# EAGLE design ModuleCarrier-Laird-BL600-v1.1 (EAGLE 7.7.0)

## Sheet 1 of 2
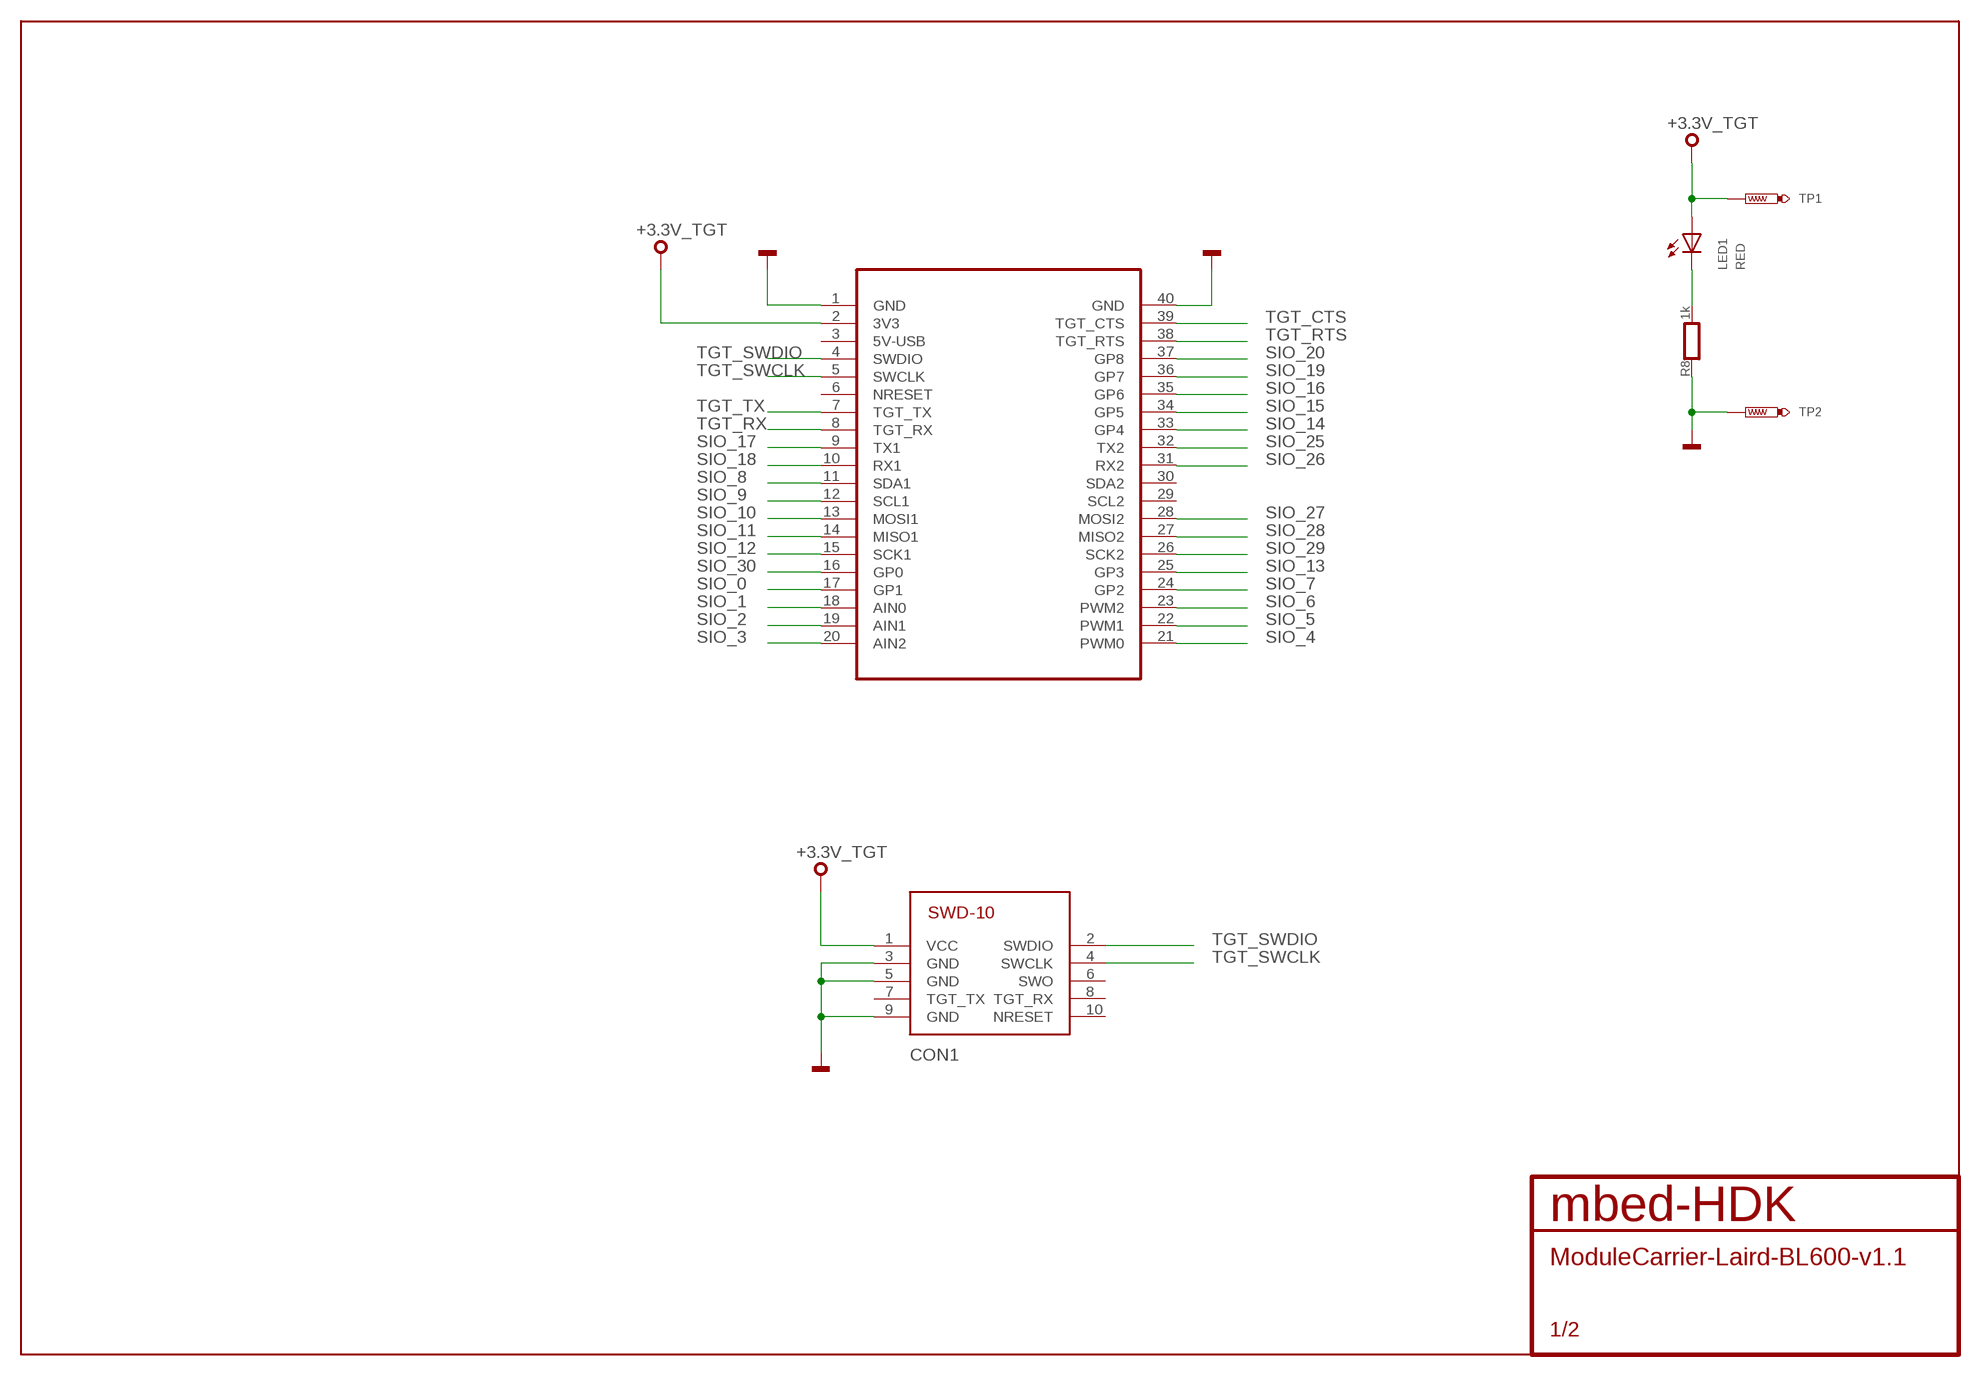
[diagram p0: schematic, sheet 1]

### Parts
CON1  SWD-10/TC2050_SMD  [FTSH-105-02]
LED1  RED  SMD_LED0603  [CHIPLED_0603]
R8  1k  RESISTOR0603  [0603]
TP1  TEST-POINT-50R-PTH  [TP50-PTH]
TP2  TEST-POINT-50R-PTH  [TP50-PTH]
U$1  MODULE_DAUGHTER  [MODULE_DAUGHTER]

### Nets
+3.3V_TGT: CON1.1(VCC) LED1.A TP1.TP U$1.2(3V3) ; also sheet 2
GND: CON1.3(GND) CON1.5(GND) CON1.9(GND) R8.1 TP2.TP U$1.1(GND) U$1.40(GND) ; also sheet 2
PA_1: LED1.C R8.2
SIO_0: U$1.17(GP1) ; also sheet 2
SIO_1: U$1.18(AIN0) ; also sheet 2
SIO_2: U$1.19(AIN1) ; also sheet 2
SIO_3: U$1.20(AIN2) ; also sheet 2
SIO_4: U$1.21(PWM0) ; also sheet 2
SIO_5: U$1.22(PWM1) ; also sheet 2
SIO_6: U$1.23(PWM2) ; also sheet 2
SIO_7: U$1.24(GP2) ; also sheet 2
SIO_8: U$1.11(SDA1) ; also sheet 2
SIO_9: U$1.12(SCL1) ; also sheet 2
SIO_10: U$1.13(MOSI1) ; also sheet 2
SIO_11: U$1.14(MISO1) ; also sheet 2
SIO_12: U$1.15(SCK1) ; also sheet 2
SIO_13: U$1.25(GP3) ; also sheet 2
SIO_14: U$1.33(GP4) ; also sheet 2
SIO_15: U$1.34(GP5) ; also sheet 2
SIO_16: U$1.35(GP6) ; also sheet 2
SIO_17: U$1.9(TX1) ; also sheet 2
SIO_18: U$1.10(RX1) ; also sheet 2
SIO_19: U$1.36(GP7) ; also sheet 2
SIO_20: U$1.37(GP8) ; also sheet 2
SIO_25: U$1.32(TX2) ; also sheet 2
SIO_26: U$1.31(RX2) ; also sheet 2
SIO_27: U$1.28(MOSI2) ; also sheet 2
SIO_28: U$1.27(MISO2) ; also sheet 2
SIO_29: U$1.26(SCK2) ; also sheet 2
SIO_30: U$1.16(GP0) ; also sheet 2
TGT_CTS: U$1.39(TGT_CTS) ; also sheet 2
TGT_RTS: U$1.38(TGT_RTS) ; also sheet 2
TGT_RX: U$1.8(TGT_RX) ; also sheet 2
TGT_SWCLK: CON1.4(SWCLK) U$1.5(SWCLK) ; also sheet 2
TGT_SWDIO: CON1.2(SWDIO) U$1.4(SWDIO) ; also sheet 2
TGT_TX: U$1.7(TGT_TX) ; also sheet 2
Unconnected: CON1.6(SWO) CON1.7(TGT_TX) CON1.8(TGT_RX) CON1.10(NRESET) U$1.3(5V-USB) U$1.6(NRESET) U$1.29(SCL2) U$1.30(SDA2)

## Sheet 2 of 2
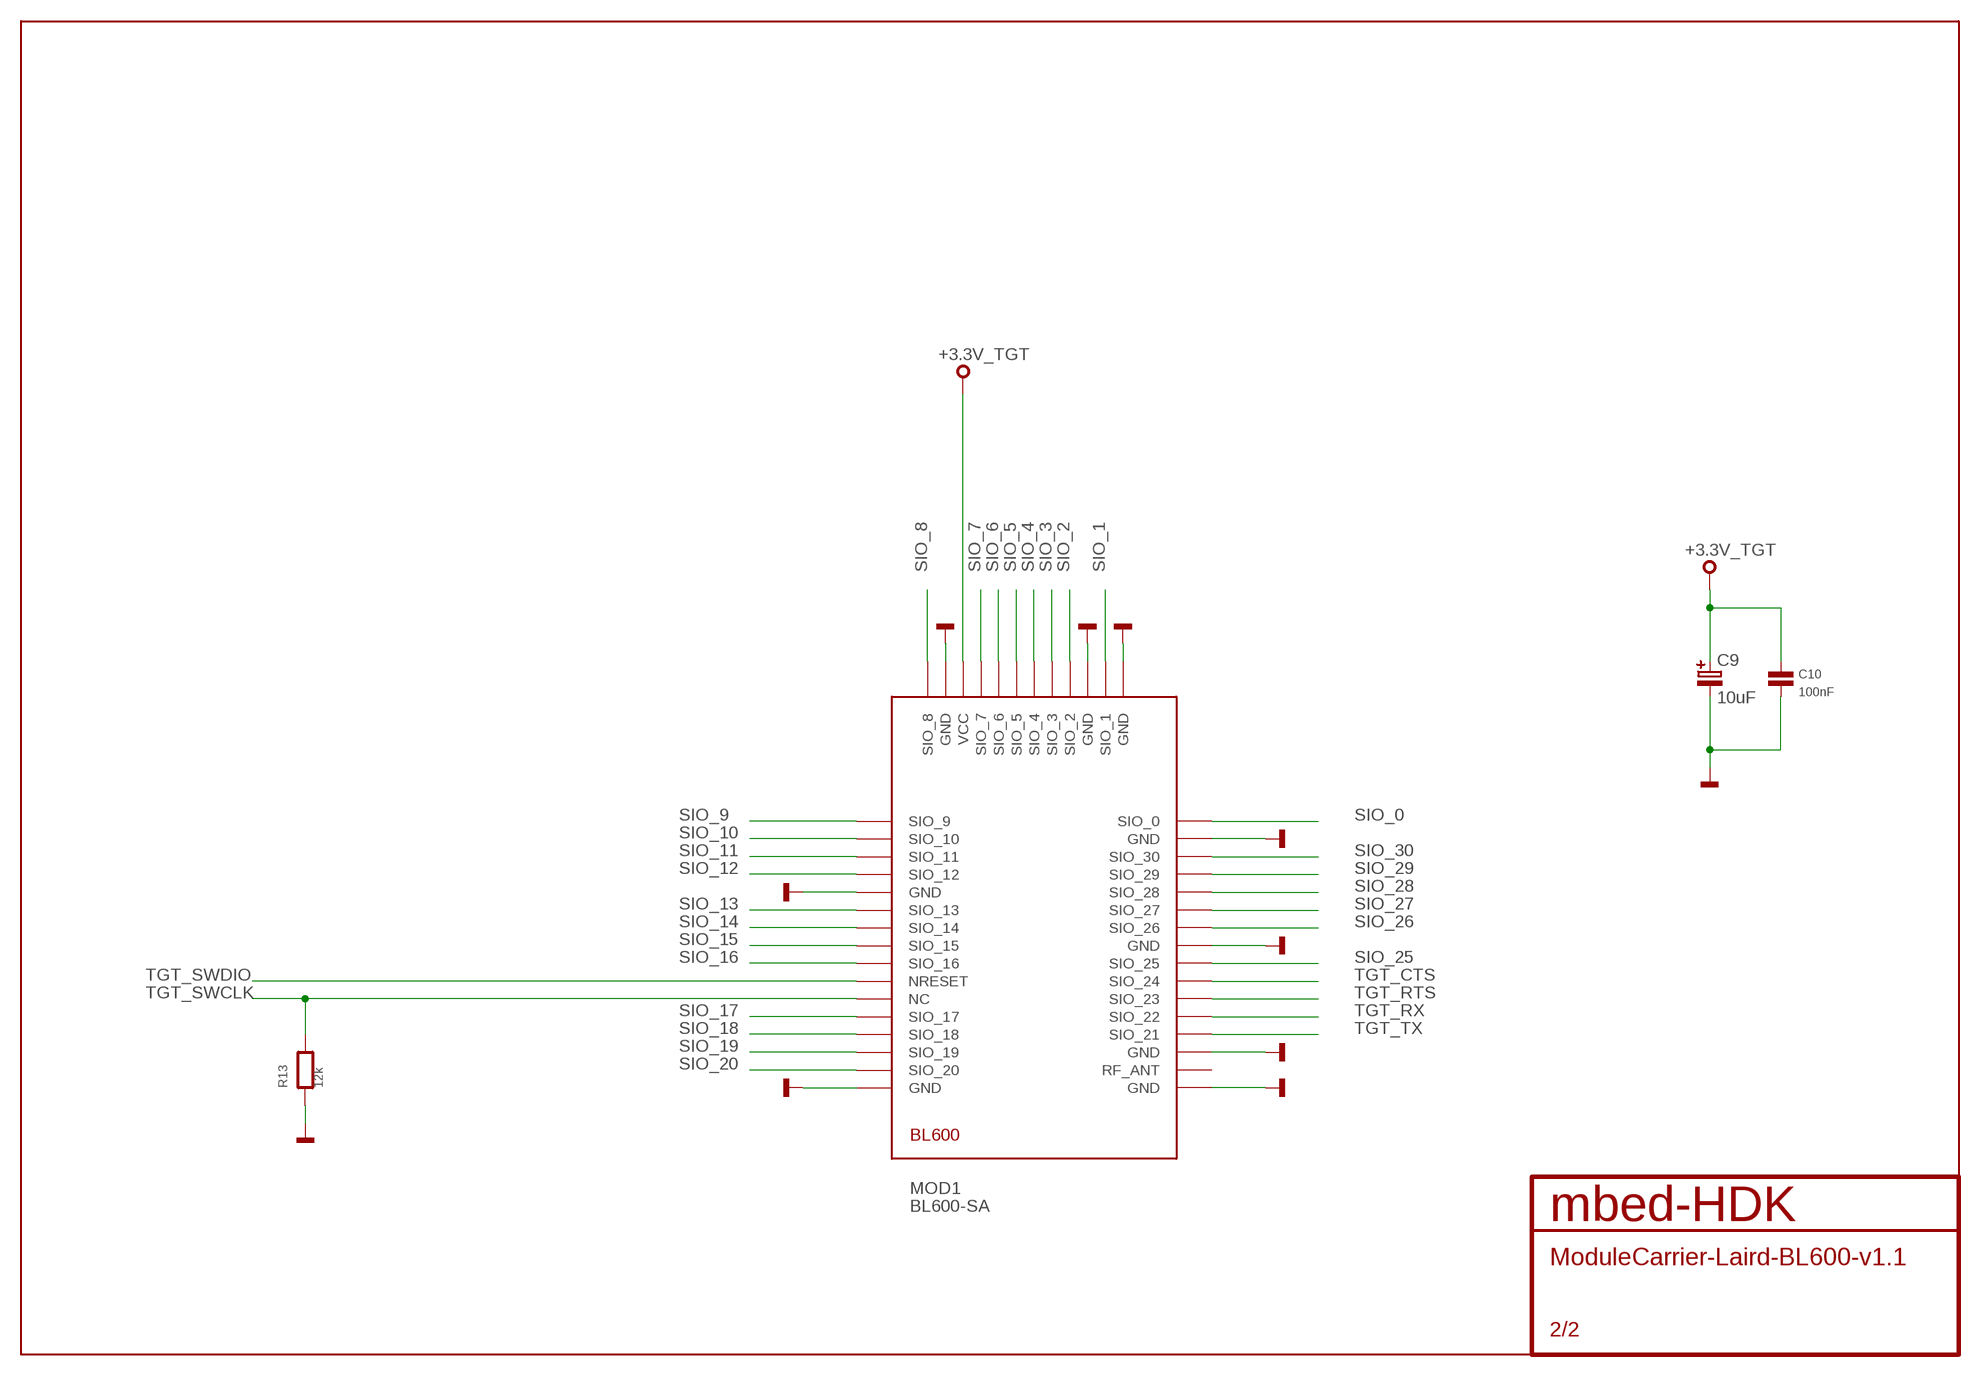
[diagram p1: schematic, sheet 2]

### Parts
C9  10uF  C-POLB  [CASE-B]
C10  100nF  C0603  [0603]
MOD1  BL600-SA  [BL600]
R13  12k  R0603  [0603]

### Nets
+3.3V_TGT: C9.1 C10.1 MOD1.P$10(VCC) ; also sheet 1
GND: C9.2 C10.2 MOD1.P$1(GND) MOD1.P$3(GND) MOD1.P$11(GND) MOD1.P$17(GND) MOD1.P$28(GND) MOD1.P$29(GND) MOD1.P$31(GND) MOD1.P$37(GND) MOD1.P$43(GND) R13.1 ; also sheet 1
SIO_0: MOD1.P$44(SIO_0) ; also sheet 1
SIO_1: MOD1.P$2(SIO_1) ; also sheet 1
SIO_2: MOD1.P$4(SIO_2) ; also sheet 1
SIO_3: MOD1.P$5(SIO_3) ; also sheet 1
SIO_4: MOD1.P$6(SIO_4) ; also sheet 1
SIO_5: MOD1.P$7(SIO_5) ; also sheet 1
SIO_6: MOD1.P$8(SIO_6) ; also sheet 1
SIO_7: MOD1.P$9(SIO_7) ; also sheet 1
SIO_8: MOD1.P$12(SIO_8) ; also sheet 1
SIO_9: MOD1.P$13(SIO_9) ; also sheet 1
SIO_10: MOD1.P$14(SIO_10) ; also sheet 1
SIO_11: MOD1.P$15(SIO_11) ; also sheet 1
SIO_12: MOD1.P$16(SIO_12) ; also sheet 1
SIO_13: MOD1.P$18(SIO_13) ; also sheet 1
SIO_14: MOD1.P$19(SIO_14) ; also sheet 1
SIO_15: MOD1.P$20(SIO_15) ; also sheet 1
SIO_16: MOD1.P$21(SIO_16) ; also sheet 1
SIO_17: MOD1.P$24(SIO_17) ; also sheet 1
SIO_18: MOD1.P$25(SIO_18) ; also sheet 1
SIO_19: MOD1.P$26(SIO_19) ; also sheet 1
SIO_20: MOD1.P$27(SIO_20) ; also sheet 1
SIO_25: MOD1.P$36(SIO_25) ; also sheet 1
SIO_26: MOD1.P$38(SIO_26) ; also sheet 1
SIO_27: MOD1.P$39(SIO_27) ; also sheet 1
SIO_28: MOD1.P$40(SIO_28) ; also sheet 1
SIO_29: MOD1.P$41(SIO_29) ; also sheet 1
SIO_30: MOD1.P$42(SIO_30) ; also sheet 1
TGT_CTS: MOD1.P$35(SIO_24) ; also sheet 1
TGT_RTS: MOD1.P$34(SIO_23) ; also sheet 1
TGT_RX: MOD1.P$33(SIO_22) ; also sheet 1
TGT_SWCLK: MOD1.P$23(NC) R13.2 ; also sheet 1
TGT_SWDIO: MOD1.P$22(NRESET) ; also sheet 1
TGT_TX: MOD1.P$32(SIO_21) ; also sheet 1
Unconnected: MOD1.P$30(RF_ANT)

## Library data of the parts
C9 = mbed-HDK:C-POL: Polarised capacitor
C10 = mbed-HDK:C: Capacitor
CON1 = mbed-HDK-Connector:SWD-10/TC2050: 1mm pitch 10-Pin Cortex Programming Header with optional TC2050 footprint solderless interchangeable
LED1 = mbed-HDK-Optical:SMD_LED: LED SMD, Colour Red; MF: Wurth Electronics Inc; MFN: 150060RS75000; OC-DIGIKEY: 732-4978-1-ND; OC-MOUSER: 710-150060RS75000; OC-NEWARK: 2322071
MOD1 = laird:BL600
R8 = mbed-HDK-RLC:RESISTOR: Resistor
R13 = mbed-HDK:R
TP1 TP2 = mbed-HDK:TEST-POINT
U$1 = Treadstone:MODULE_DAUGHTER

## Net classes
0 default: width 0.152 mm, drill 0.305 mm, clearance 0.152 mm

## Board
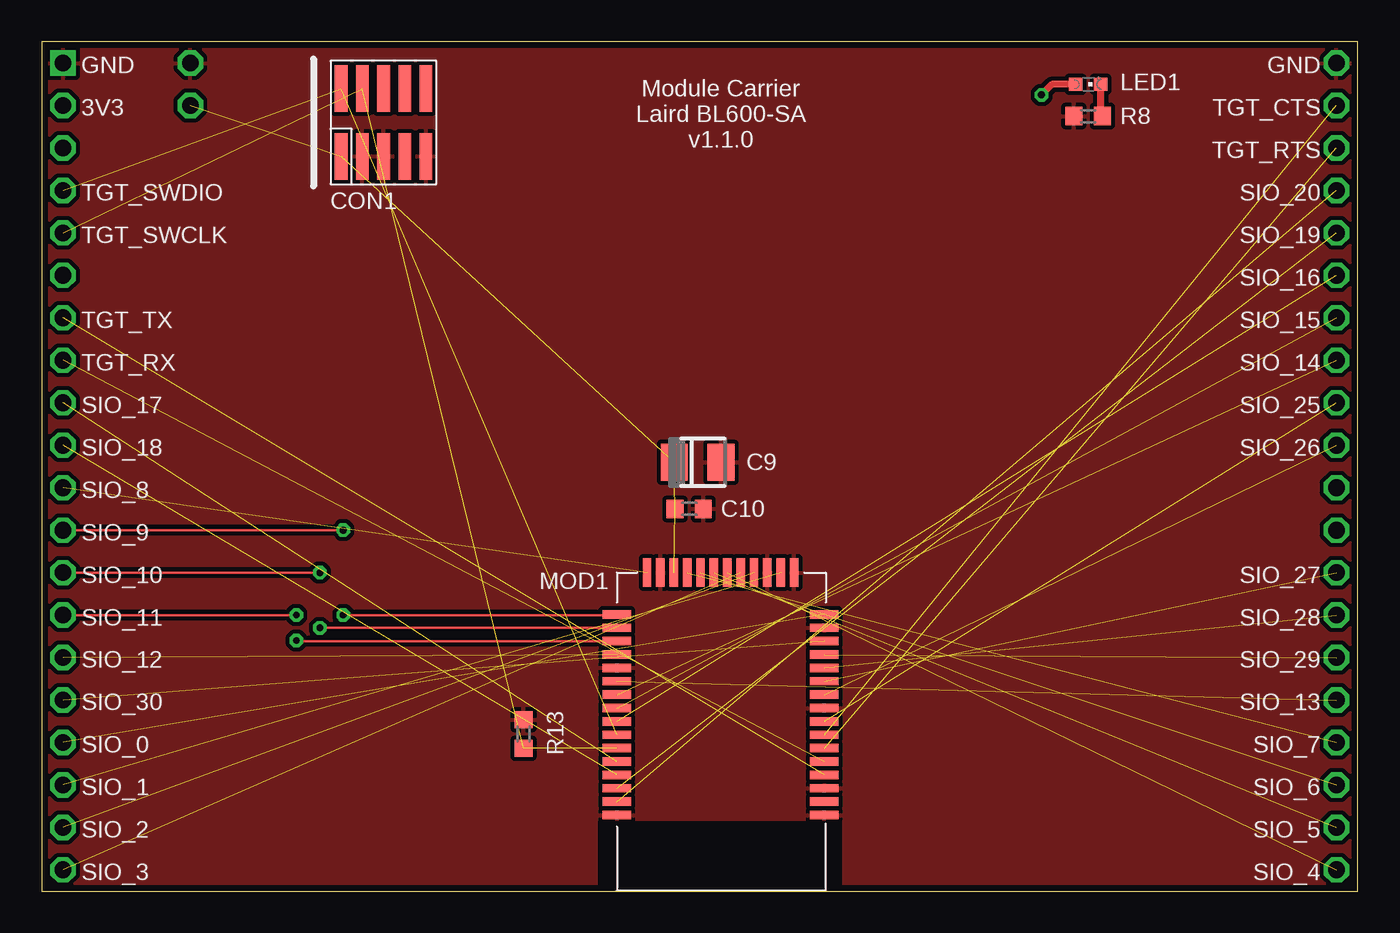
[diagram p2: board, top side]
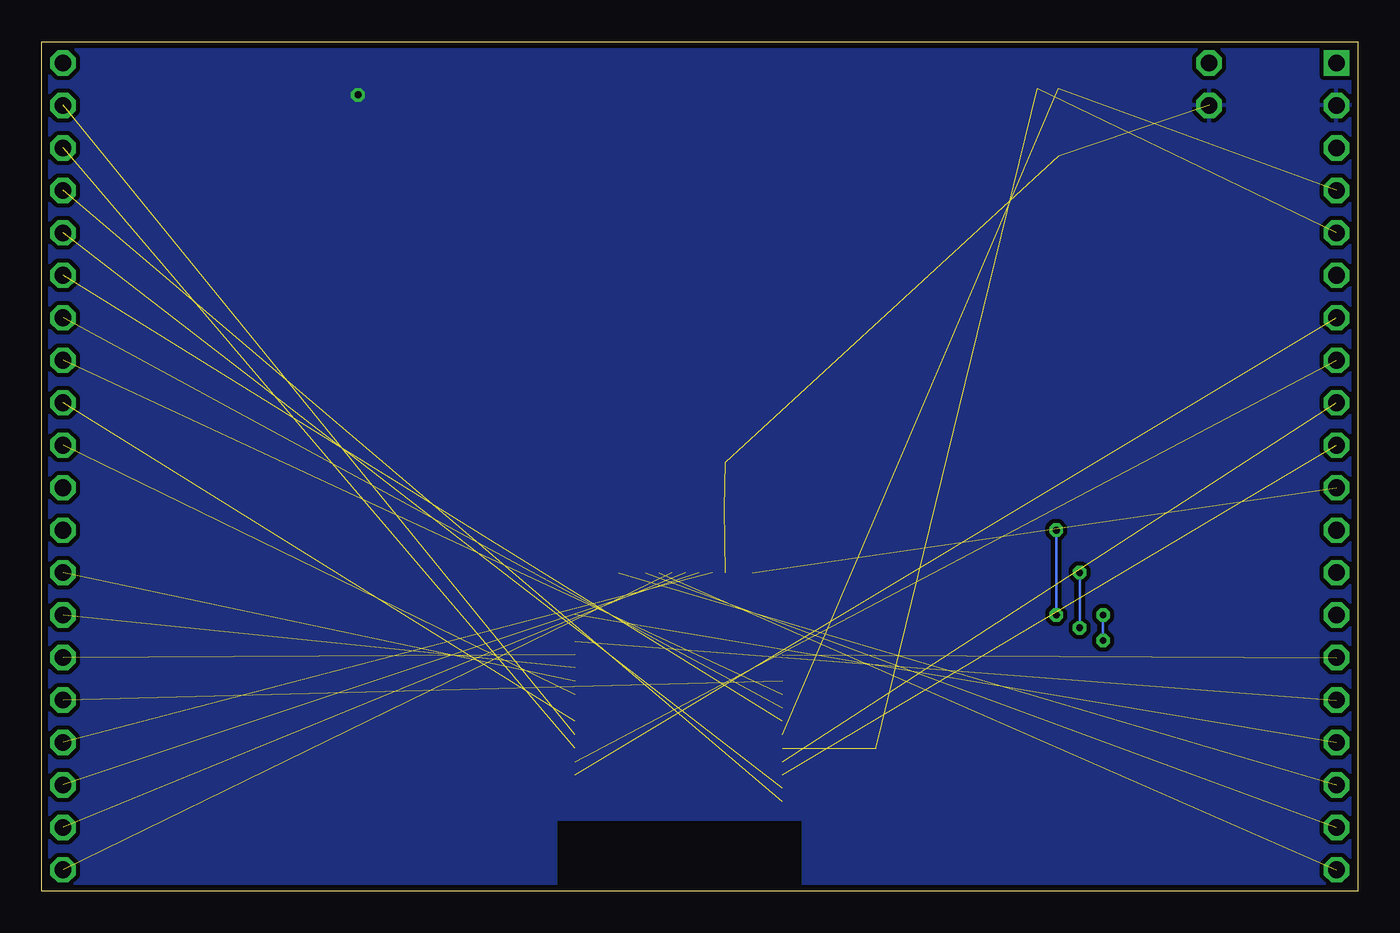
[diagram p3: board, bottom side, seen from below]

Size 78.74 x 50.8 mm. Coordinates in mm from the lower left corner, seen from the top.
Copper layers ((1*16)): Top 0.035mm / dielectric 0.8mm / Bottom 0.035mm
Design rules "mbed-HDK-6-6-2-layer-PCB-Panel": minimum track width 6mil, minimum drill 14mil, track to track 10mil, track to pad 10mil, pad to pad 10mil, via to via 10mil, smd to smd 6mil, copper to edge 15mil, drill to drill 8mil, minimum pad ring 10mil, minimum via ring 8mil, stop-mask expansion 4mil, vias tented up to drill 0mil, thermal gap 10mil
tRestrict: area 33.3,0 to 47.9,4.2
bRestrict: area 33.3,0 to 47.9,4.2

### Footprints (pad centres in the part's own frame; a part is rotated, then mirrored left to right if it is on the bottom)
CASE-B = smd 1.6 x 2.2: 1 -1.4,0; 2 1.4,0
0603 = smd 1 x 1.1: 1 -0.85,0; 2 0.85,0
FTSH-105-02 = smd 0.762 x 2.794: 1 0.381,-2.032; 2 0.381,2.032; 3 1.651,-2.032; 4 1.651,2.032; 5 2.921,-2.032; 6 2.921,2.032; 7 4.191,-2.032; 8 4.191,2.032; 9 5.461,-2.032; 10 5.461,2.032
CHIPLED_0603 = smd 0.8 x 0.8: A 0,-0.75; C 0,0.75
BL600 = smd 1.7 x 0.5: P$1 0,10.6; P$2 0,9.8; P$3 0,9; P$4 0,8.2; P$5 0,7.4; P$6 0,6.6; P$7 0,5.8; P$8 0,5; P$9 0,4.2; P$10 0,3.4; P$11 0,2.6; P$12 0,1.8 | smd 0.5 x 1.7: P$13 2.5,0; P$14 3.3,0; P$15 4.1,0; P$16 4.9,0; P$17 5.7,0; P$18 6.5,0; P$19 7.3,0; P$20 8.1,0; P$21 8.9,0; P$22 9.7,0; P$23 10.5,0; P$24 11.3,0; P$25 12.1,0; P$26 12.9,0; P$27 13.7,0; P$28 14.5,0; P$29 14.5,12.4; P$30 13.7,12.4; P$31 12.9,12.4; P$32 12.1,12.4; P$33 11.3,12.4; P$34 10.5,12.4; P$35 9.7,12.4; P$36 8.9,12.4; P$37 8.1,12.4; P$38 7.3,12.4; P$39 6.5,12.4; P$40 5.7,12.4; P$41 4.9,12.4; P$42 4.1,12.4; P$43 3.3,12.4; P$44 2.5,12.4
TP50-PTH = drill 1 octagon: TP 0,0
MODULE_DAUGHTER = drill 1 square: 1 0,0 | drill 1 octagon: 2 0,-2.54; 3 0,-5.08; 4 0,-7.62; 5 0,-10.16; 6 0,-12.7; 7 0,-15.24; 8 0,-17.78; 9 0,-20.32; 10 0,-22.86; 11 0,-25.4; 12 0,-27.94; 13 0,-30.48; 14 0,-33.02; 15 0,-35.56; 16 0,-38.1; 17 0,-40.64; 18 0,-43.18; 19 0,-45.72; 20 0,-48.26; 21 76.2,-48.26; 22 76.2,-45.72; 23 76.2,-43.18; 24 76.2,-40.64; 25 76.2,-38.1; 26 76.2,-35.56; 27 76.2,-33.02; 28 76.2,-30.48; 29 76.2,-27.94; 30 76.2,-25.4; 31 76.2,-22.86; 32 76.2,-20.32; 33 76.2,-17.78; 34 76.2,-15.24; 35 76.2,-12.7; 36 76.2,-10.16; 37 76.2,-7.62; 38 76.2,-5.08; 39 76.2,-2.54; 40 76.2,0

### Placement (x,y rotation side)
C9  39.24,25.65 0 top
C10  38.74,22.86 0 top
CON1  17.53,45.97 0 top
LED1  62.61,48.26 270 top
MOD1  34.42,19.05 270 top
R8  62.61,46.36 0 top
R13  28.83,9.4 270 top
TP1  8.89,46.99 0 top
TP2  8.89,49.53 0 top
U$1  1.27,49.53 0 top

### Tracks (layer width: path | path; a pad name or v marks a point on that pad's centre or on a via)
+3.3V_TGT  (via drill 0.41)  (4 unrouted)
  Top 0.406: LED1.A 60.45,48.26 v59.82,47.62
  pour Bottom: 0,0 78.74,0 78.74,50.8 0,50.8
GND
  pour Top: 0,50.8 78.74,50.8 78.74,0 0,0
PA_1
  Top 0.406: R8.2 63.36,46.36 LED1.C
SIO_0  (1 unrouted)
SIO_1  (1 unrouted)
SIO_2  (1 unrouted)
SIO_3  (1 unrouted)
SIO_4  (1 unrouted)
SIO_5  (1 unrouted)
SIO_6  (1 unrouted)
SIO_7  (1 unrouted)
SIO_8  (1 unrouted)
SIO_9  (via drill 0.41)
  Top 0.152: MOD1.P$13 34.38,16.51 v18.03,16.51 | v18.03,21.59 U$1.12
  Bottom 0.152: v18.03,16.51 v18.03,21.59
SIO_10  (via drill 0.41)
  Top 0.152: MOD1.P$14 v16.64,15.75 | v16.64,19.05 U$1.13
  Bottom 0.152: v16.64,15.75 v16.64,19.05
SIO_11  (via drill 0.41)
  Top 0.152: MOD1.P$15 15.24,14.95 v15.24,14.99 | v15.24,16.51 U$1.14
  Bottom 0.152: v15.24,14.99 v15.24,16.51
SIO_12  (1 unrouted)
SIO_13  (1 unrouted)
SIO_14  (1 unrouted)
SIO_15  (1 unrouted)
SIO_16  (1 unrouted)
SIO_17  (1 unrouted)
SIO_18  (1 unrouted)
SIO_19  (1 unrouted)
SIO_20  (1 unrouted)
SIO_25  (1 unrouted)
SIO_26  (1 unrouted)
SIO_27  (1 unrouted)
SIO_28  (1 unrouted)
SIO_29  (1 unrouted)
SIO_30  (1 unrouted)
TGT_CTS  (1 unrouted)
TGT_RTS  (1 unrouted)
TGT_RX  (1 unrouted)
TGT_SWCLK  (3 unrouted)
TGT_SWDIO  (2 unrouted)
TGT_TX  (1 unrouted)

### Text on the board
tPlace: GND / 3V3 / / TGT_SWDIO / TGT_SWCLK / / TGT_TX / TGT_RX / SIO_17 / SIO_18 / SIO_8 / SIO_9 / SIO_10 / SIO_11 / SIO_12 / SIO_30 / SIO_0 / SIO_1 / SIO_2 / SIO_3 | GND / TGT_CTS / TGT_RTS / SIO_20 / SIO_19 / SIO_16 / SIO_15 / SIO_14 / SIO_25 / SIO_26 / / / SIO_27 / SIO_28 / SIO_29 / SIO_13 / SIO_7 / SIO_6 / SIO_5 / SIO_4 | Module Carrier / Laird BL600-SA / v1.1.0